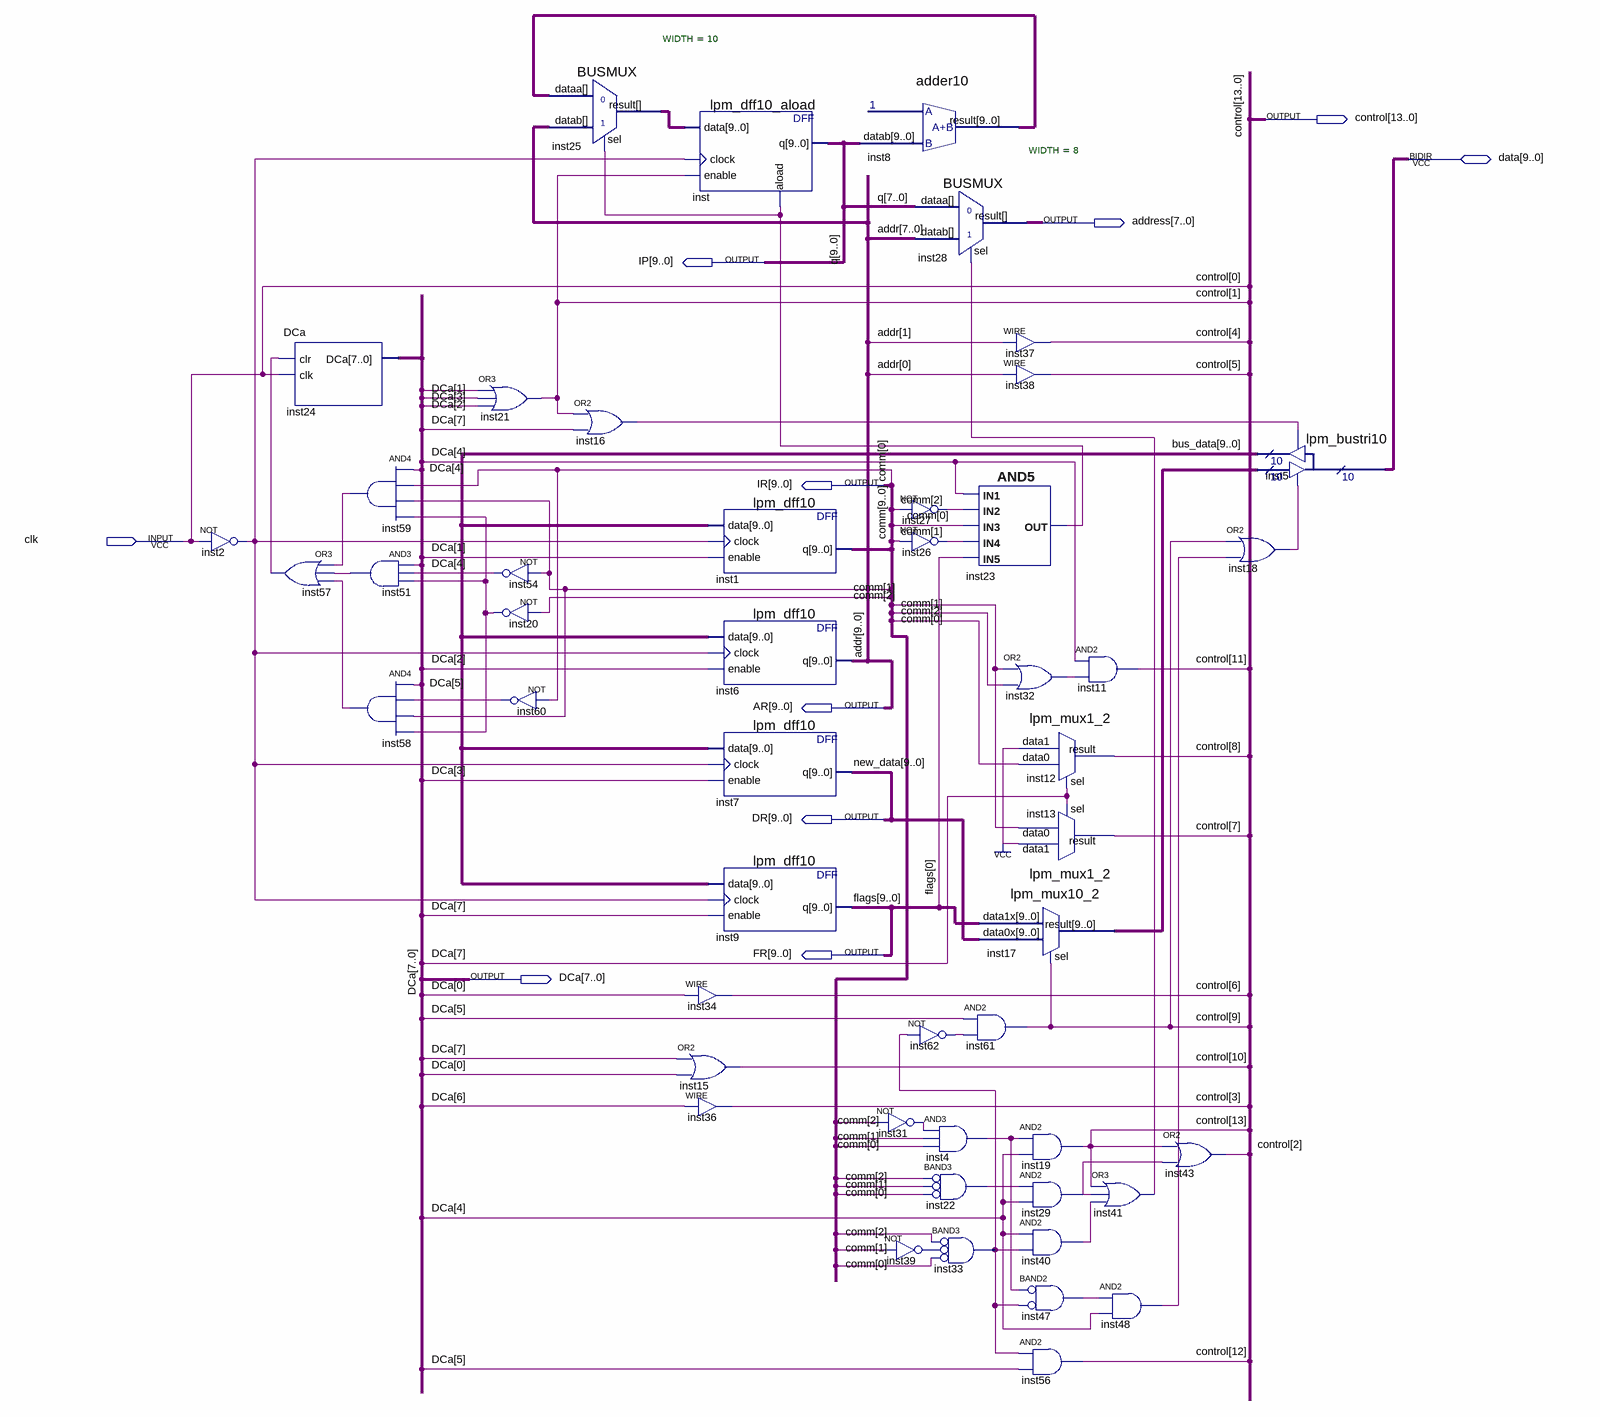
[diagram p0: schematic sheet]
// Quartus schematic cu.bdf as structural Verilog: 49 symbols, 10 pins
module cu (
  input  clk,
  inout  [9:0] data,
  output [13:0] control,
  output [7:0] address,
  output [9:0] IP,
  output [9:0] IR,
  output [9:0] AR,
  output [9:0] DR,
  output [9:0] FR,
  output [7:0] DCa
);

  wire inst2_out, inst4_out, inst16_out, inst18_out, inst20_out, inst22_out, inst23_out, inst26_out,
       inst27_out, inst29_out, inst31_out, inst32_out, inst33_out, inst39_out, inst40_out, inst41_out,
       inst47_out, inst48_out, inst51_out, inst54_out, inst57_out, inst58_out, inst59_out, inst60_out,
       inst62_out;
  wire [9:0] bus_data, inst8_result, inst17_result, inst25_result;

  not inst2 (inst2_out, clk);
  DCa inst24 (.clr(inst57_out), .clk(clk), .DCa(DCa));
  or inst57 (inst57_out, inst59_out, inst51_out, inst58_out);
  and inst59 (inst59_out, DCa[4], IR[0], IR[1], inst20_out);
  and inst51 (inst51_out, DCa[4], inst54_out, inst20_out);
  and inst58 (inst58_out, DCa[5], inst60_out, IR[1], inst20_out);
  or inst21 (control[1], DCa[1], DCa[3], DCa[2]);
  not inst54 (inst54_out, IR[1]);
  not inst20 (inst20_out, IR[2]);
  BUSMUX #(.WIDTH(10)) inst25 (.datab(AR), .sel(inst23_out), .dataa(inst8_result), .result(inst25_result));
  not inst60 (inst60_out, IR[0]);
  or inst16 (inst16_out, control[1], DCa[7]);
  lpm_dff10_aload inst (.data(inst25_result), .clock(inst2_out), .enable(control[1]), .aload(inst23_out), .q(IP));
  assign control[6] = DCa[0];  // WIRE inst34
  or inst15 (control[10], DCa[7], DCa[0]);
  assign control[3] = DCa[6];  // WIRE inst36
  lpm_dff10 inst1 (.data(bus_data), .clock(inst2_out), .enable(DCa[1]), .q(IR));
  lpm_dff10 inst6 (.data(bus_data), .clock(inst2_out), .enable(DCa[2]), .q(AR));
  lpm_dff10 inst7 (.data(bus_data), .clock(inst2_out), .enable(DCa[3]), .q(DR));
  lpm_dff10 inst9 (.data(bus_data), .clock(inst2_out), .enable(DCa[7]), .q(FR));
  adder10 inst8 (.datab(IP), .result(inst8_result));
  not inst31 (inst31_out, IR[2]);
  BUSMUX #(.WIDTH(8)) inst28 (.datab(AR[7:0]), .sel(inst41_out), .dataa(IP[7:0]), .result(address));
  not inst27 (inst27_out, IR[2]);
  not inst26 (inst26_out, IR[1]);
  not inst62 (inst62_out, inst33_out);
  and inst4 (inst4_out, inst31_out, IR[1], IR[0]);
  and inst22 (inst22_out, ~IR[2], ~IR[1], ~IR[0]);  // BAND3
  and inst33 (inst33_out, ~IR[2], ~inst39_out, ~IR[0]);  // BAND3
  not inst39 (inst39_out, IR[1]);
  assign control[4] = AR[1];  // WIRE inst37
  assign control[5] = AR[0];  // WIRE inst38
  and inst23 (inst23_out, DCa[4], inst27_out, IR[0], inst26_out, FR[0]);
  or inst32 (inst32_out, IR[1], IR[2]);
  lpm_mux10_2 inst17 (.data1x(FR), .data0x(DR), .sel(control[9]), .result(inst17_result));
  and inst61 (control[9], DCa[5], inst62_out);
  lpm_mux1_2 inst12 (.data1(1'b1), .data0(IR[0]), .sel(DCa[7]), .result(control[8]));
  lpm_mux1_2 inst13 (.data1(1'b1), .data0(IR[1]), .sel(DCa[7]), .result(control[7]));
  and inst19 (control[13], inst4_out, DCa[4]);
  and inst29 (inst29_out, inst22_out, DCa[4]);
  and inst40 (inst40_out, DCa[4], inst33_out);
  and inst47 (inst47_out, ~inst4_out, ~inst33_out);  // BAND2
  and inst56 (control[12], inst33_out, DCa[5]);
  and inst11 (control[11], DCa[4], inst32_out);
  or inst41 (inst41_out, control[13], inst29_out, inst40_out);
  and inst48 (inst48_out, inst47_out, DCa[4]);
  or inst43 (control[2], control[13], inst29_out);
  lpm_bustri10 inst5 (
    .enabledt(inst18_out), .data(inst17_result), .enabletr(inst16_out), .result(bus_data), .tridata(data));
  or inst18 (inst18_out, control[9], inst48_out);

  assign control[0] = clk;

  // Other names for the same wires on the sheet: addr[9:0] = AR; new_data[9:0] = DR; flags[9:0] = FR; q[9:0] = IP;
  //   comm[9:0] = IR
endmodule
